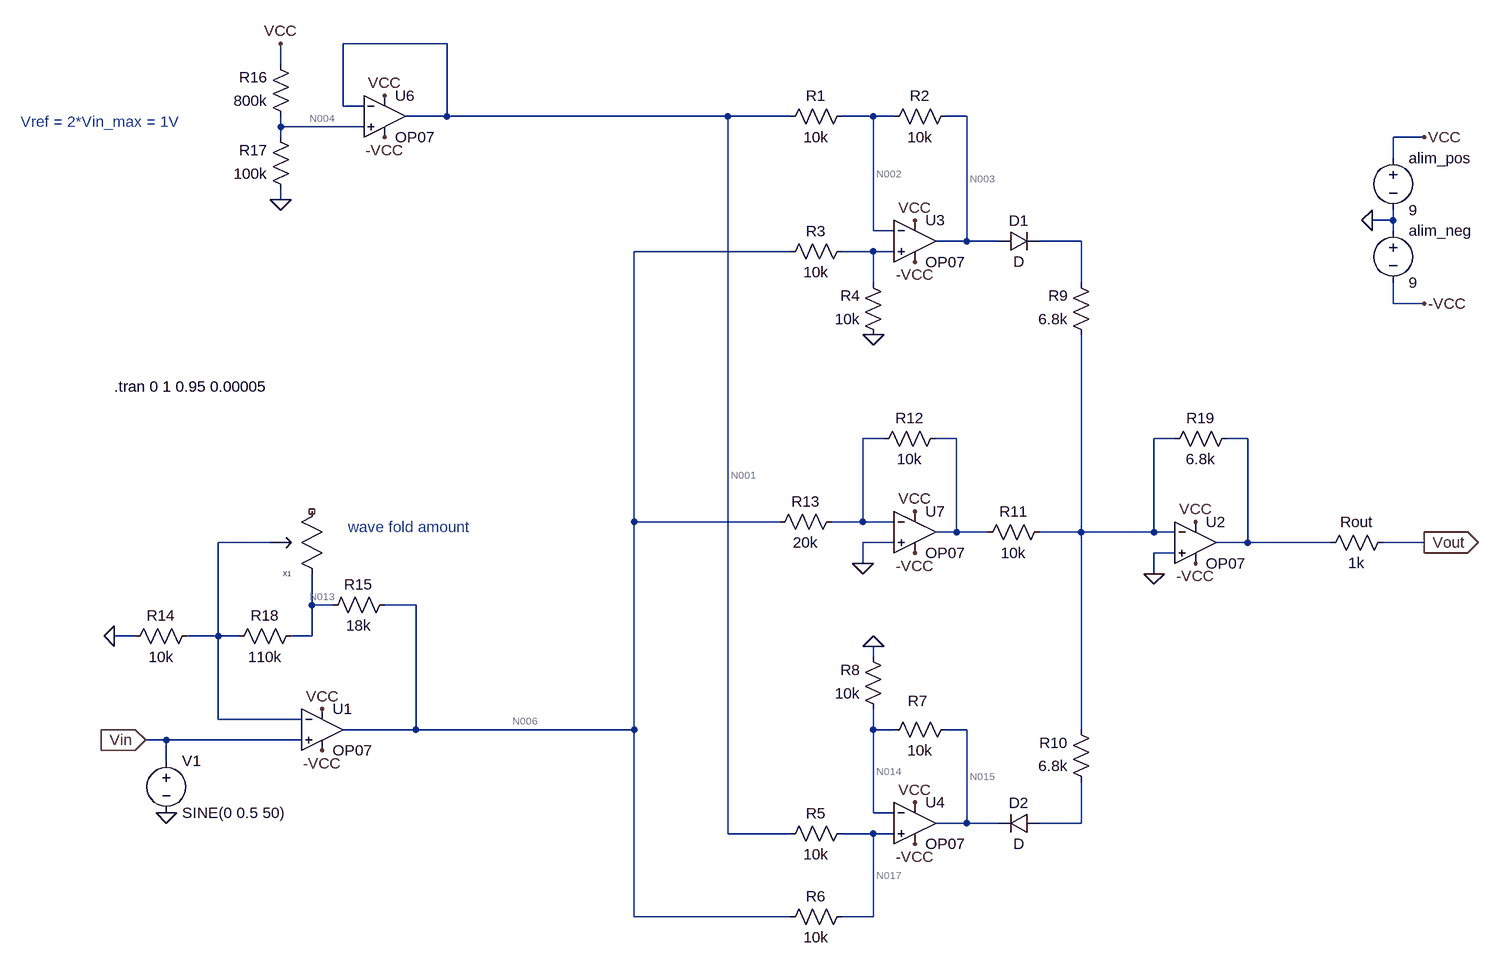
[diagram p0: schematic wave_folder_V2.asc]
wave_folder_V2.asc, the LTspice schematic file:
Version 4.1
SHEET 1 1536 864
WIRE -704 -528 -864 -528
WIRE -960 -496 -960 -528
WIRE -864 -432 -864 -528
WIRE -832 -432 -864 -432
WIRE -704 -416 -704 -528
WIRE -704 -416 -768 -416
WIRE -272 -416 -704 -416
WIRE -176 -416 -272 -416
WIRE -48 -416 -96 -416
WIRE -16 -416 -48 -416
WIRE 96 -416 64 -416
WIRE -960 -400 -960 -416
WIRE -832 -400 -960 -400
WIRE -960 -384 -960 -400
WIRE 800 -384 752 -384
WIRE 752 -352 752 -384
WIRE -960 -288 -960 -304
WIRE 752 -256 752 -272
WIRE 752 -256 720 -256
WIRE -48 -240 -48 -416
WIRE -16 -240 -48 -240
WIRE 752 -240 752 -256
WIRE 96 -224 96 -416
WIRE 96 -224 48 -224
WIRE 144 -224 96 -224
WIRE 272 -224 208 -224
WIRE -176 -208 -416 -208
WIRE -48 -208 -96 -208
WIRE -16 -208 -48 -208
WIRE -48 -160 -48 -208
WIRE 272 -160 272 -224
WIRE 752 -128 752 -160
WIRE 800 -128 752 -128
WIRE -32 80 -64 80
WIRE 80 80 48 80
WIRE 416 80 384 80
WIRE 528 80 496 80
WIRE -416 208 -416 -208
WIRE -192 208 -416 208
WIRE -64 208 -64 80
WIRE -64 208 -112 208
WIRE -16 208 -64 208
WIRE 80 224 80 80
WIRE 80 224 48 224
WIRE 128 224 80 224
WIRE 272 224 272 -80
WIRE 272 224 208 224
WIRE 384 224 384 80
WIRE 384 224 272 224
WIRE 416 224 384 224
WIRE -976 240 -1056 240
WIRE -16 240 -64 240
WIRE 528 240 528 80
WIRE 528 240 480 240
WIRE 656 240 528 240
WIRE 800 240 736 240
WIRE 416 256 384 256
WIRE -64 272 -64 240
WIRE 384 288 384 256
WIRE -912 336 -912 288
WIRE -880 336 -912 336
WIRE -752 336 -800 336
WIRE -1184 384 -1216 384
WIRE -1056 384 -1056 240
WIRE -1056 384 -1104 384
WIRE -1024 384 -1056 384
WIRE -912 384 -912 336
WIRE -912 384 -944 384
WIRE -48 416 -48 400
WIRE -1056 512 -1056 384
WIRE -928 512 -1056 512
WIRE -752 528 -752 336
WIRE -752 528 -864 528
WIRE -416 528 -416 208
WIRE -416 528 -752 528
WIRE -48 528 -48 496
WIRE -16 528 -48 528
WIRE 96 528 64 528
WIRE 272 528 272 224
WIRE -1136 544 -1168 544
WIRE -928 544 -1136 544
WIRE -1136 576 -1136 544
WIRE -48 656 -48 528
WIRE -16 656 -48 656
WIRE 96 672 96 528
WIRE 96 672 48 672
WIRE 144 672 96 672
WIRE 272 672 272 608
WIRE 272 672 208 672
WIRE -272 688 -272 -416
WIRE -176 688 -272 688
WIRE -48 688 -96 688
WIRE -16 688 -48 688
WIRE -416 816 -416 528
WIRE -176 816 -416 816
WIRE -48 816 -48 688
WIRE -48 816 -96 816
FLAG -1168 544 Vin
IOPIN -1168 544 In
FLAG 720 -256 0
FLAG 800 240 Vout
IOPIN 800 240 Out
FLAG 800 -384 VCC
FLAG 800 -128 -VCC
FLAG -896 496 VCC
FLAG 16 -256 VCC
FLAG 16 -192 -VCC
FLAG -896 560 -VCC
FLAG -1136 656 0
FLAG -48 -80 0
FLAG -960 -528 VCC
FLAG 16 640 VCC
FLAG 16 704 -VCC
FLAG 448 208 VCC
FLAG 448 272 -VCC
FLAG 384 288 0
FLAG -1216 384 0
FLAG -800 -448 VCC
FLAG -800 -384 -VCC
FLAG -960 -288 0
FLAG 16 192 VCC
FLAG 16 256 -VCC
FLAG -64 272 0
FLAG -48 400 0
SYMBOL res -80 -432 R90
WINDOW 0 0 56 VBottom 2
WINDOW 3 32 56 VTop 2
SYMATTR InstName R1
SYMATTR Value 10k
SYMBOL res -32 -400 R270
WINDOW 0 32 56 VTop 2
WINDOW 3 0 56 VBottom 2
SYMATTR InstName R2
SYMATTR Value 10k
SYMBOL res -80 -224 R90
WINDOW 0 0 56 VBottom 2
WINDOW 3 32 56 VTop 2
SYMATTR InstName R3
SYMATTR Value 10k
SYMBOL res -32 -64 R180
WINDOW 0 36 76 Left 2
WINDOW 3 36 40 Left 2
SYMATTR InstName R4
SYMATTR Value 10k
SYMBOL OpAmps\\OP07 -896 464 R0
SYMATTR InstName U1
SYMBOL voltage 752 -368 R0
SYMATTR InstName alim_pos
SYMATTR Value 9
SYMBOL voltage 752 -256 R0
SYMATTR InstName alim_neg
SYMATTR Value 9
SYMBOL OpAmps\\OP07 448 176 R0
SYMATTR InstName U2
SYMBOL OpAmps\\OP07 16 -288 R0
SYMATTR InstName U3
SYMBOL pot -880 272 R180
SYMATTR InstName X1
SYMATTR SpiceLine R = 50k val = 100
SYMBOL voltage -1136 560 R0
WINDOW 123 0 0 Left 0
WINDOW 39 0 0 Left 0
SYMATTR InstName V1
SYMATTR Value SINE(0 0.5 50)
SYMBOL diode 144 -208 R270
WINDOW 0 32 32 VTop 2
WINDOW 3 0 32 VBottom 2
SYMATTR InstName D1
SYMBOL diode 208 656 R90
WINDOW 0 0 32 VBottom 2
WINDOW 3 32 32 VTop 2
SYMATTR InstName D2
SYMBOL res -80 672 R90
WINDOW 0 0 56 VBottom 2
WINDOW 3 32 56 VTop 2
SYMATTR InstName R5
SYMATTR Value 10k
SYMBOL res -192 832 R270
WINDOW 0 32 56 VTop 2
WINDOW 3 0 56 VBottom 2
SYMATTR InstName R6
SYMATTR Value 10k
SYMBOL res 80 512 R90
WINDOW 0 -13 59 VBottom 2
WINDOW 3 32 56 VTop 2
SYMATTR InstName R7
SYMATTR Value 10k
SYMBOL res -32 512 R180
WINDOW 0 36 76 Left 2
WINDOW 3 36 40 Left 2
SYMATTR InstName R8
SYMATTR Value 10k
SYMBOL OpAmps\\OP07 16 608 R0
SYMATTR InstName U4
SYMBOL res 288 -64 R180
WINDOW 0 36 76 Left 2
WINDOW 3 36 40 Left 2
SYMATTR InstName R9
SYMATTR Value 6.8k
SYMBOL res 288 624 R180
WINDOW 0 36 76 Left 2
WINDOW 3 36 40 Left 2
SYMATTR InstName R10
SYMATTR Value 6.8k
SYMBOL res 112 240 R270
WINDOW 0 32 56 VTop 2
WINDOW 3 0 56 VBottom 2
SYMATTR InstName R11
SYMATTR Value 10k
SYMBOL res 64 64 R90
WINDOW 0 0 56 VBottom 2
WINDOW 3 32 56 VTop 2
SYMATTR InstName R12
SYMATTR Value 10k
SYMBOL res -96 192 R90
WINDOW 0 0 56 VBottom 2
WINDOW 3 32 56 VTop 2
SYMATTR InstName R13
SYMATTR Value 20k
SYMBOL res -1088 368 R90
WINDOW 0 0 56 VBottom 2
WINDOW 3 32 56 VTop 2
SYMATTR InstName R14
SYMATTR Value 10k
SYMBOL res -784 320 R90
WINDOW 0 0 56 VBottom 2
WINDOW 3 32 56 VTop 2
SYMATTR InstName R15
SYMATTR Value 18k
SYMBOL res 752 224 R90
WINDOW 0 0 56 VBottom 2
WINDOW 3 32 56 VTop 2
SYMATTR InstName Rout
SYMATTR Value 1k
SYMBOL OpAmps\\OP07 -800 -480 R0
SYMATTR InstName U6
SYMBOL res -944 -400 R180
WINDOW 0 36 76 Left 2
WINDOW 3 36 40 Left 2
SYMATTR InstName R16
SYMATTR Value 800k
SYMBOL res -944 -288 R180
WINDOW 0 36 76 Left 2
WINDOW 3 36 40 Left 2
SYMATTR InstName R17
SYMATTR Value 100k
SYMBOL res -928 368 R90
WINDOW 0 0 56 VBottom 2
WINDOW 3 32 56 VTop 2
SYMATTR InstName R18
SYMATTR Value 110k
SYMBOL OpAmps\\OP07 16 160 R0
SYMATTR InstName U7
SYMBOL res 512 64 R90
WINDOW 0 0 56 VBottom 2
WINDOW 3 32 56 VTop 2
SYMATTR InstName R19
SYMATTR Value 6.8k
TEXT -1216 0 Left 2 !.tran 0 1 0.95 0.00005
TEXT -1360 -408 Left 2 ;Vref = 2*Vin_max = 1V
TEXT -856 216 Left 2 ;wave fold amount

The netlist it stands for:
* wave_folder_V2.asc
R1 N002 N001 10k
R2 N002 N003 10k
R3 N007 N006 10k
R4 0 N007 10k
X§U1 Vin N012 VCC -VCC N006 LT1001  ; OP07, pins In+ In- V+ V- OUT
V§alim_pos VCC 0 9
V§alim_neg 0 -VCC 9
X§U2 0 N010 VCC -VCC N011 LT1001  ; OP07, pins In+ In- V+ V- OUT
X§U3 N007 N002 VCC -VCC N003 LT1001  ; OP07, pins In+ In- V+ V- OUT
X§X1 N013 N012 NC_01 pot R = 50k val = 100  ; pins 1 2 3
V1 Vin 0 SINE(0 0.5 50)
D1 N003 N005 D
D2 N016 N015 D
R5 N017 N001 10k
R6 N006 N017 10k
R7 N015 N014 10k
R8 N014 0 10k
X§U4 N017 N014 VCC -VCC N015 LT1001  ; OP07, pins In+ In- V+ V- OUT
R9 N010 N005 6.8k
R10 N016 N010 6.8k
R11 N009 N010 10k
R12 N009 N008 10k
R13 N008 N006 20k
R14 N012 0 10k
R15 N006 N013 18k
Rout Vout N011 1k
X§U6 N004 N001 VCC -VCC N001 LT1001  ; OP07, pins In+ In- V+ V- OUT
R16 N004 VCC 800k
R17 0 N004 100k
R18 N013 N012 110k
X§U7 0 N008 VCC -VCC N009 LT1001  ; OP07, pins In+ In- V+ V- OUT
R19 N011 N010 6.8k
.model D D
.lib standard.dio
.tran 0 1 0.95 0.00005
* Vref = 2*Vin_max = 1V
* wave fold amount
.lib LTC.lib
.backanno
.end

* Results of the author's LTspice run, read from the files saved beside the schematic
* Operating Point, zero values left out:
*   V(n001) = 1 V
*   V(n006) = 14 nV
*   V(n013) = 9.96 nV
*   V(n014) = 500 mV
*   V(n002) = 1.351 µV
*   V(n003) = -1 V
*   V(vcc) = 9 V
*   V(-vcc) = -9 V
*   V(n015) = 1 V
*   V(n017) = 500 mV
*   V(n004) = 1 V
*   I(alim_neg) = -13.48 mA
*   I(R6) = -50 µA
*   I(R7) = 50 µA
*   I(R10) = 1.01 pA
*   I(R1) = -100 µA
*   I(D2) = -1.01 pA
*   I(R16) = -10 µA
*   I(R2) = 100 µA
*   I(alim_pos) = -13.54 mA
*   I(R5) = -50 µA
*   I(R8) = 50 µA
*   I(R9) = 1.01 pA
*   I(D1) = -1.01 pA
*   I(R17) = -10 µA
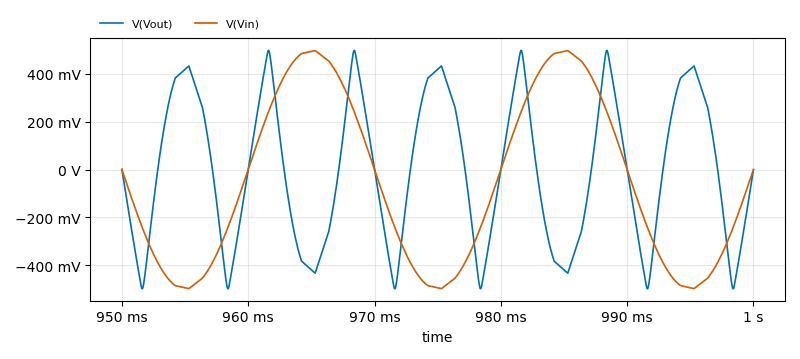
[diagram p1: Transient Analysis of wave_folder_V2.asc, plotted from the saved traces]
* Transient Analysis, 1 run:
*   V(Vout): min -498.5 mV, max 498.5 mV, average -5.164 mV, rms 306.7 mV, last -584.8 µV
*   V(Vin): min -497.7 mV, max 497.7 mV, average -63.44 mV, rms 352.3 mV, last 0 V